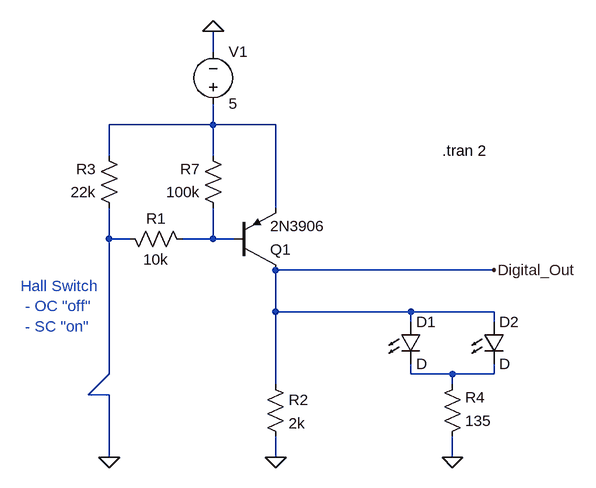
[diagram p0: schematic killswitch.asc]
killswitch.asc, the LTspice schematic file:
Version 4
SHEET 1 1806 36
WIRE 672 -704 672 -736
WIRE 672 -592 672 -624
WIRE 672 -592 512 -592
WIRE 768 -592 672 -592
WIRE 512 -544 512 -592
WIRE 672 -544 672 -592
WIRE 768 -464 768 -592
WIRE 512 -416 512 -464
WIRE 544 -416 512 -416
WIRE 672 -416 672 -464
WIRE 672 -416 624 -416
WIRE 704 -416 672 -416
WIRE 1104 -368 768 -368
WIRE 768 -304 768 -368
WIRE 976 -304 768 -304
WIRE 1104 -304 976 -304
WIRE 976 -288 976 -304
WIRE 1104 -288 1104 -304
WIRE 512 -208 512 -416
WIRE 976 -208 976 -224
WIRE 1040 -208 976 -208
WIRE 1104 -208 1104 -224
WIRE 1104 -208 1040 -208
WIRE 768 -192 768 -304
WIRE 1040 -192 1040 -208
WIRE 480 -176 512 -208
WIRE 512 -176 480 -176
WIRE 512 -80 512 -176
WIRE 768 -80 768 -112
WIRE 1040 -80 1040 -112
FLAG 1040 -80 0
FLAG 768 -80 0
FLAG 672 -736 0
FLAG 512 -80 0
FLAG 1104 -368 Digital_Out
SYMBOL res 528 -448 R180
WINDOW 0 36 76 Left 2
WINDOW 3 36 40 Left 2
SYMATTR InstName R3
SYMATTR Value 22k
SYMBOL pnp 704 -368 M180
SYMATTR InstName Q1
SYMATTR Value 2N3906
SYMBOL res 1024 -96 M180
WINDOW 0 36 76 Left 2
WINDOW 3 36 40 Left 2
SYMATTR InstName R4
SYMATTR Value 135
SYMBOL voltage 672 -608 M180
WINDOW 0 24 96 Left 2
WINDOW 3 24 16 Left 2
WINDOW 123 0 0 Left 2
WINDOW 39 0 0 Left 2
SYMATTR InstName V1
SYMATTR Value 5
SYMBOL res 528 -432 M90
WINDOW 0 0 56 VBottom 2
WINDOW 3 32 56 VTop 2
SYMATTR InstName R1
SYMATTR Value 10k
SYMBOL res 688 -448 R180
WINDOW 0 36 76 Left 2
WINDOW 3 36 40 Left 2
SYMATTR InstName R7
SYMATTR Value 100k
SYMBOL res 752 -208 R0
SYMATTR InstName R2
SYMATTR Value 2k
SYMBOL LED 960 -288 R0
SYMATTR InstName D1
SYMBOL LED 1088 -288 R0
SYMATTR InstName D2
TEXT 1024 -552 Left 2 !.tran 2
TEXT 376 -344 Left 2 ;Hall Switch\n - OC "off"\n - SC "on"

The netlist it stands for:
* killswitch.asc
R3 0 N001 22k
Q1 Digital_Out N002 N001 0 2N3906
R4 0 N003 135
V1 N001 0 5
R1 0 N002 10k
R7 N002 N001 100k
R2 Digital_Out 0 2k
D1 Digital_Out N003 D
D2 Digital_Out N003 D
.model D D
.lib standard.dio
.model NPN NPN
.model PNP PNP
.lib standard.bjt
.tran 2
* Hall Switch
*  - OC "off"
*  - SC "on"
.backanno
.end